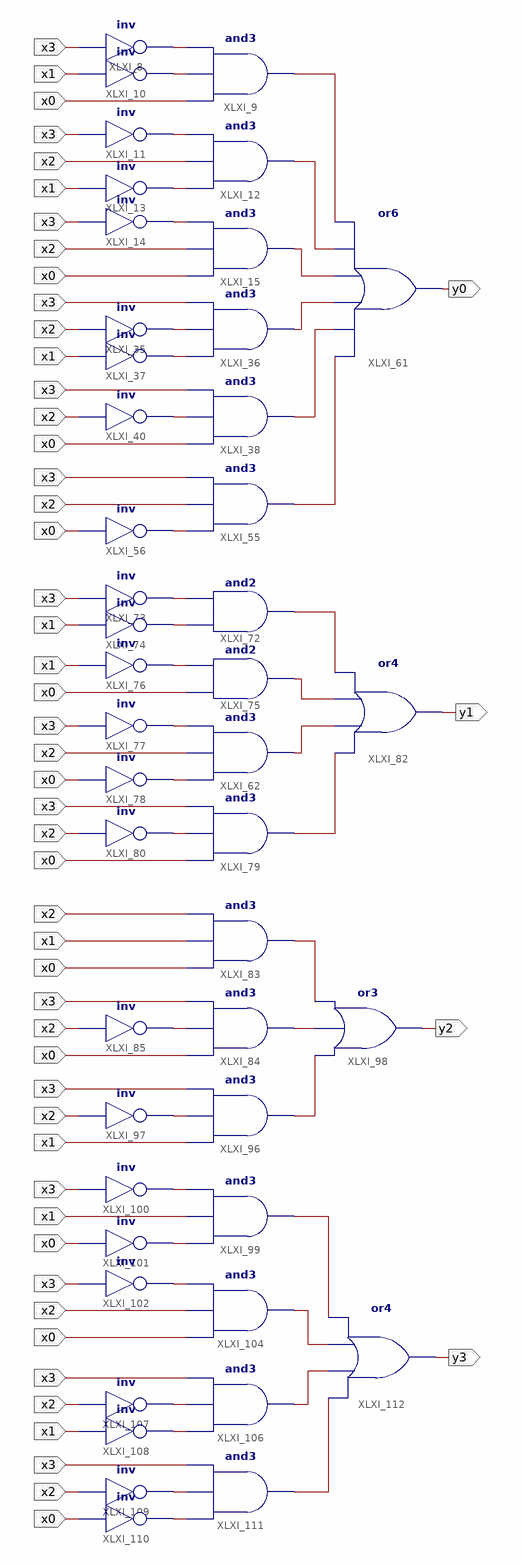
[diagram p0: schematic sheet 1]
// Xilinx ISE schematic Schem.sch (artix7) as structural Verilog: 45 symbols, 8 ports
module Schem (
  input  x3,
  input  x0,
  input  x2,
  input  x1,
  output y0,
  output y1,
  output y2,
  output y3
);

  wire XLXN_20, XLXN_21, XLXN_22, XLXN_23, XLXN_24, XLXN_25, XLXN_27, XLXN_28, XLXN_29, XLXN_50, XLXN_51,
       XLXN_53, XLXN_54, XLXN_55, XLXN_56, XLXN_99, XLXN_100, XLXN_112, XLXN_113, XLXN_114, XLXN_118,
       XLXN_120, XLXN_122, XLXN_123, XLXN_124, XLXN_138, XLXN_143, XLXN_153, XLXN_154, XLXN_155, XLXN_157,
       XLXN_158, XLXN_160, XLXN_162, XLXN_163, XLXN_164, XLXN_165, XLXN_179, XLXN_180, XLXN_181, XLXN_182;

  not XLXI_8 (XLXN_20, x3);
  and XLXI_9 (XLXN_50, x0, XLXN_21, XLXN_20);
  not XLXI_10 (XLXN_21, x1);
  not XLXI_11 (XLXN_22, x3);
  and XLXI_12 (XLXN_51, XLXN_23, x2, XLXN_22);
  not XLXI_13 (XLXN_23, x1);
  not XLXI_14 (XLXN_24, x3);
  and XLXI_15 (XLXN_56, x0, x2, XLXN_24);
  and XLXI_36 (XLXN_53, XLXN_27, XLXN_25, x3);
  not XLXI_37 (XLXN_27, x1);
  not XLXI_35 (XLXN_25, x2);
  and XLXI_38 (XLXN_54, x0, XLXN_28, x3);
  not XLXI_40 (XLXN_28, x2);
  and XLXI_55 (XLXN_55, XLXN_29, x2, x3);
  not XLXI_56 (XLXN_29, x0);
  or XLXI_61 (y0, XLXN_55, XLXN_54, XLXN_53, XLXN_56, XLXN_51, XLXN_50);
  and XLXI_62 (XLXN_123, XLXN_113, x2, XLXN_114);
  and XLXI_72 (XLXN_120, XLXN_100, XLXN_99);
  not XLXI_73 (XLXN_99, x3);
  not XLXI_74 (XLXN_100, x1);
  and XLXI_75 (XLXN_122, x0, XLXN_112);
  not XLXI_77 (XLXN_114, x3);
  not XLXI_78 (XLXN_113, x0);
  and XLXI_79 (XLXN_124, x0, XLXN_118, x3);
  not XLXI_80 (XLXN_118, x2);
  not XLXI_76 (XLXN_112, x1);
  or XLXI_82 (y1, XLXN_124, XLXN_123, XLXN_122, XLXN_120);
  and XLXI_83 (XLXN_153, x0, x1, x2);
  not XLXI_85 (XLXN_138, x2);
  and XLXI_84 (XLXN_154, x0, XLXN_138, x3);
  and XLXI_96 (XLXN_155, x1, XLXN_143, x3);
  not XLXI_97 (XLXN_143, x2);
  or XLXI_98 (y2, XLXN_155, XLXN_154, XLXN_153);
  and XLXI_99 (XLXN_179, XLXN_157, x1, XLXN_158);
  not XLXI_100 (XLXN_158, x3);
  not XLXI_101 (XLXN_157, x0);
  not XLXI_102 (XLXN_160, x3);
  and XLXI_104 (XLXN_180, x0, x2, XLXN_160);
  or XLXI_112 (y3, XLXN_182, XLXN_181, XLXN_180, XLXN_179);
  not XLXI_107 (XLXN_163, x2);
  not XLXI_108 (XLXN_162, x1);
  and XLXI_106 (XLXN_181, XLXN_162, XLXN_163, x3);
  not XLXI_109 (XLXN_165, x2);
  not XLXI_110 (XLXN_164, x0);
  and XLXI_111 (XLXN_182, XLXN_164, XLXN_165, x3);
endmodule
